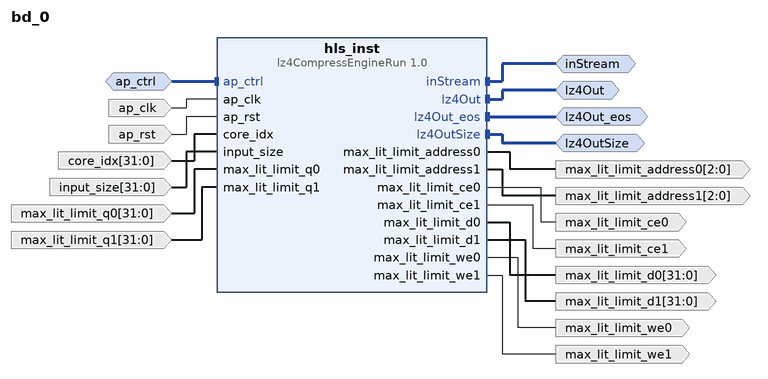
[diagram p0: block diagram of the top level]
# Vivado block design bd_0, xc7z020clg484-1, Vivado 2024.2
create_bd_design bd_0

create_bd_intf_port -mode Slave -vlnv xilinx.com:interface:acc_handshake_rtl:1.0 ap_ctrl
create_bd_intf_port -mode Master -vlnv xilinx.com:interface:acc_fifo_read_rtl:1.0 inStream
create_bd_intf_port -mode Master -vlnv xilinx.com:interface:acc_fifo_write_rtl:1.0 lz4Out
create_bd_intf_port -mode Master -vlnv xilinx.com:interface:acc_fifo_write_rtl:1.0 lz4OutSize
create_bd_intf_port -mode Master -vlnv xilinx.com:interface:acc_fifo_write_rtl:1.0 lz4Out_eos
create_bd_port -dir I -type clk ap_clk
set_property -dict {CONFIG.FREQ_HZ 142000000.0} [get_bd_ports ap_clk]
create_bd_port -dir I -type rst ap_rst
set_property -dict {CONFIG.POLARITY ACTIVE_HIGH} [get_bd_ports ap_rst]
create_bd_port -dir I -from 31 -to 0 -type data core_idx
create_bd_port -dir I -from 31 -to 0 -type data input_size
create_bd_port -dir O -from 2 -to 0 -type data max_lit_limit_address0
create_bd_port -dir O -from 2 -to 0 -type data max_lit_limit_address1
create_bd_port -dir O max_lit_limit_ce0
create_bd_port -dir O max_lit_limit_ce1
create_bd_port -dir O -from 31 -to 0 -type data max_lit_limit_d0
create_bd_port -dir O -from 31 -to 0 -type data max_lit_limit_d1
create_bd_port -dir I -from 31 -to 0 -type data max_lit_limit_q0
create_bd_port -dir I -from 31 -to 0 -type data max_lit_limit_q1
create_bd_port -dir O max_lit_limit_we0
create_bd_port -dir O max_lit_limit_we1

create_bd_cell -type ip -vlnv xilinx.com:hls:lz4CompressEngineRun:1.0 hls_inst

# ---- connections ----

connect_bd_intf_net -intf_net ap_ctrl_0_1 [get_bd_intf_ports ap_ctrl] [get_bd_intf_pins hls_inst/ap_ctrl]
connect_bd_intf_net [get_bd_intf_ports inStream] [get_bd_intf_pins hls_inst/inStream]
connect_bd_intf_net [get_bd_intf_ports lz4Out] [get_bd_intf_pins hls_inst/lz4Out]
connect_bd_intf_net [get_bd_intf_ports lz4OutSize] [get_bd_intf_pins hls_inst/lz4OutSize]
connect_bd_intf_net [get_bd_intf_ports lz4Out_eos] [get_bd_intf_pins hls_inst/lz4Out_eos]
connect_bd_net -net ap_clk_0_1 [get_bd_ports ap_clk] [get_bd_pins hls_inst/ap_clk]
connect_bd_net -net ap_rst_0_1 [get_bd_ports ap_rst] [get_bd_pins hls_inst/ap_rst]
connect_bd_net -net core_idx_0_1 [get_bd_ports core_idx] [get_bd_pins hls_inst/core_idx]
connect_bd_net [get_bd_pins hls_inst/max_lit_limit_address0] [get_bd_ports max_lit_limit_address0]
connect_bd_net [get_bd_pins hls_inst/max_lit_limit_address1] [get_bd_ports max_lit_limit_address1]
connect_bd_net [get_bd_pins hls_inst/max_lit_limit_ce0] [get_bd_ports max_lit_limit_ce0]
connect_bd_net [get_bd_pins hls_inst/max_lit_limit_ce1] [get_bd_ports max_lit_limit_ce1]
connect_bd_net [get_bd_pins hls_inst/max_lit_limit_d0] [get_bd_ports max_lit_limit_d0]
connect_bd_net [get_bd_pins hls_inst/max_lit_limit_d1] [get_bd_ports max_lit_limit_d1]
connect_bd_net [get_bd_pins hls_inst/max_lit_limit_we0] [get_bd_ports max_lit_limit_we0]
connect_bd_net [get_bd_pins hls_inst/max_lit_limit_we1] [get_bd_ports max_lit_limit_we1]
connect_bd_net -net input_size_0_1 [get_bd_ports input_size] [get_bd_pins hls_inst/input_size]
connect_bd_net -net max_lit_limit_q0_0_1 [get_bd_ports max_lit_limit_q0] [get_bd_pins hls_inst/max_lit_limit_q0]
connect_bd_net -net max_lit_limit_q1_0_1 [get_bd_ports max_lit_limit_q1] [get_bd_pins hls_inst/max_lit_limit_q1]

validate_bd_design
save_bd_design
